# Altium schematic sheet Transmitters.SchDoc: Communications Card Interfaces
size A3; Revision: 1A; SheetNumber: 5; SheetTotal: 5; Organization: Brickworks; Address1: Matthew Glazer; Address2: Design Engineer
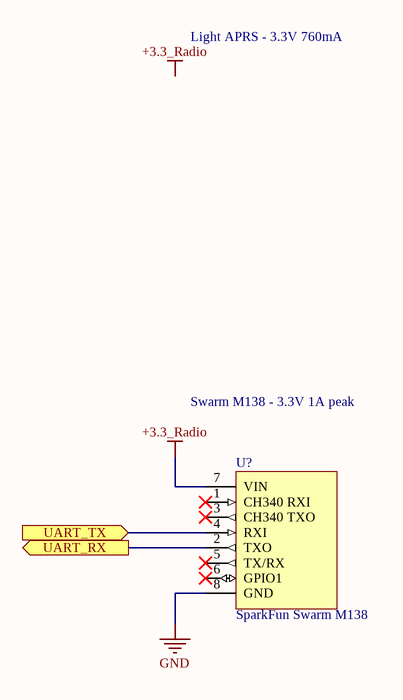
[diagram p0: Transmitters.SchDoc]

## Parts
U?  SparkFun Swarm M138  [SWARM_M138]

## Ports
UART_RX (out), UART_TX (in)

## Nets
+3.3_Radio: U?.7(VIN)
GND: U?.8(GND)
UART_RX: U?.2(TXO) ; port UART_RX
UART_TX: U?.4(RXI) ; port UART_TX

Not connected (* = marked no-connect by the designer): U? 1(CH340_RXI)* 3(CH340_TXO)* 5(TX/RX)* 6(GPIO1)*

## Notes on the sheet
- Light APRS - 3.3V 760mA
- Swarm M138 - 3.3V 1A peak
- Labels drawn without touching a wire or pin: +3.3_Radio
- Title
- Size:
- Date:
- A3
- Number:
- Time:
- Revision:
- Sheet
- of
- File: